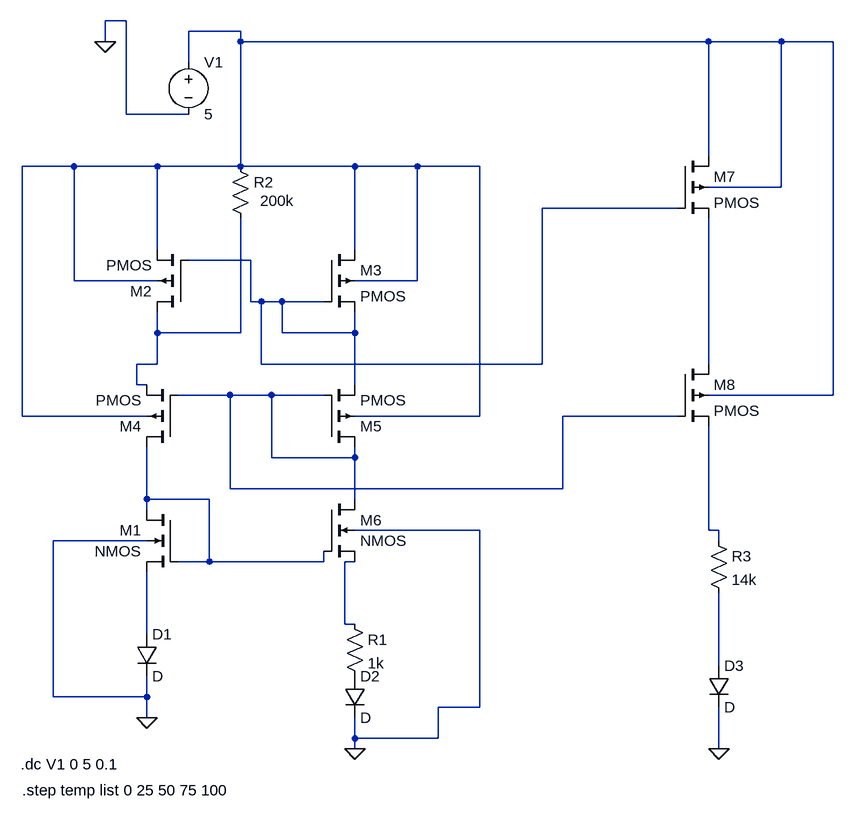
[diagram p0: schematic BANDGAP_REFERENCE_CIRCUIT.asc]
BANDGAP_REFERENCE_CIRCUIT.asc, the LTspice schematic file:
Version 4
SHEET 1 880 768
WIRE -224 -432 -256 -432
WIRE -48 -416 -128 -416
WIRE -256 -400 -256 -432
WIRE -48 -400 -48 -416
WIRE 672 -400 -48 -400
WIRE 784 -400 672 -400
WIRE 864 -400 784 -400
WIRE -128 -368 -128 -416
WIRE -224 -288 -224 -432
WIRE -128 -288 -224 -288
WIRE 672 -224 672 -400
WIRE -304 -208 -384 -208
WIRE -176 -208 -304 -208
WIRE -48 -208 -48 -400
WIRE -48 -208 -176 -208
WIRE 128 -208 -48 -208
WIRE 224 -208 128 -208
WIRE 320 -208 224 -208
WIRE 784 -176 784 -400
WIRE 784 -176 672 -176
WIRE 624 -144 416 -144
WIRE -176 -80 -176 -208
WIRE 128 -80 128 -208
WIRE -32 -64 -128 -64
WIRE -304 -32 -304 -208
WIRE -176 -32 -304 -32
WIRE 224 -32 224 -208
WIRE 224 -32 128 -32
WIRE -32 0 -32 -64
WIRE -16 0 -32 0
WIRE 16 0 -16 0
WIRE 80 0 16 0
WIRE -176 48 -176 16
WIRE -48 48 -48 -128
WIRE -48 48 -176 48
WIRE 16 48 16 0
WIRE 128 48 128 16
WIRE 128 48 16 48
WIRE -176 96 -176 48
WIRE -176 96 -208 96
WIRE -16 96 -16 0
WIRE 416 96 416 -144
WIRE 416 96 -16 96
WIRE 672 96 672 -128
WIRE -208 128 -208 96
WIRE -192 128 -208 128
WIRE 128 128 128 48
WIRE -64 144 -144 144
WIRE 0 144 -64 144
WIRE 80 144 0 144
WIRE 864 144 864 -400
WIRE 864 144 672 144
WIRE -384 176 -384 -208
WIRE -192 176 -384 176
WIRE 320 176 320 -208
WIRE 320 176 128 176
WIRE 624 176 448 176
WIRE 0 240 0 144
WIRE 128 240 128 224
WIRE 128 240 0 240
WIRE -64 288 -64 144
WIRE 448 288 448 176
WIRE 448 288 -64 288
WIRE -192 304 -192 224
WIRE -96 304 -192 304
WIRE 128 304 128 240
WIRE -192 320 -192 304
WIRE 320 352 128 352
WIRE 672 352 672 192
WIRE 688 352 672 352
WIRE -192 368 -336 368
WIRE 688 368 688 352
WIRE -96 400 -96 304
WIRE -96 400 -144 400
WIRE 80 400 80 384
WIRE 80 400 -96 400
WIRE 128 400 112 400
WIRE 112 496 112 400
WIRE 128 496 112 496
WIRE -192 512 -192 416
WIRE 688 560 688 448
WIRE -336 608 -336 368
WIRE -192 608 -192 576
WIRE -192 608 -336 608
WIRE 320 624 320 352
WIRE 320 624 256 624
WIRE -192 640 -192 608
WIRE 128 672 128 640
WIRE 256 672 256 624
WIRE 256 672 128 672
WIRE 128 688 128 672
WIRE 688 688 688 624
FLAG 128 688 0
FLAG -192 640 0
FLAG -256 -400 0
FLAG 688 688 0
SYMBOL nmos4 -144 320 M0
WINDOW 3 56 64 Left 2
SYMATTR InstName M1
SYMATTR Value2 l=1u w=25u
SYMBOL pmos4 -128 16 R180
SYMATTR InstName M2
SYMATTR Value2 l=1u w=50u
SYMBOL pmos4 80 -80 R0
SYMATTR InstName M3
SYMATTR Value2 l=1u w=50u
SYMBOL pmos4 -144 224 R180
SYMATTR InstName M4
SYMATTR Value2 l=1u w=50u
SYMBOL pmos4 80 224 M180
SYMATTR InstName M5
SYMATTR Value2 l=1u w=50u
SYMBOL nmos4 80 304 R0
WINDOW 3 56 64 Left 2
SYMATTR InstName M6
SYMATTR Value2 l=1u w=25u
SYMBOL res 112 480 R0
SYMATTR InstName R1
SYMATTR Value 1k
SYMBOL diode -208 512 R0
SYMATTR InstName D1
SYMBOL diode 112 576 R0
SYMATTR InstName D2
SYMBOL res -64 -224 R0
WINDOW 3 46 69 Left 2
SYMATTR InstName R2
SYMATTR Value 200k
SYMBOL voltage -128 -384 R0
WINDOW 123 0 0 Left 0
WINDOW 39 0 0 Left 0
SYMATTR InstName V1
SYMATTR Value 5
SYMBOL pmos4 624 -224 R0
SYMATTR InstName M7
SYMATTR Value2 l=1u w=100u
SYMBOL pmos4 624 96 R0
SYMATTR InstName M8
SYMATTR Value2 l=1u w=100u
SYMBOL res 672 352 R0
SYMATTR InstName R3
SYMATTR Value 14k
SYMBOL diode 672 560 R0
SYMATTR InstName D3
TEXT -386 712 Left 2 !.dc V1 0 5 0.1
TEXT -384 752 Left 2 !.step temp list 0 25 50 75 100

The netlist it stands for:
* BANDGAP_REFERENCE_CIRCUIT.asc
M1 N006 N006 N009 0 NMOS l=1u w=25u
M2 N003 N002 N001 N001 PMOS l=1u w=50u
M3 N001 N002 N002 N001 PMOS l=1u w=50u
M4 N006 N005 N003 N001 PMOS l=1u w=50u
M5 N005 N005 N002 N001 PMOS l=1u w=50u
M6 N005 N006 N008 0 NMOS l=1u w=25u
R1 N008 P001 1k
D1 N009 0 D
D2 P001 0 D
R2 N001 N003 200k
V1 N001 0 5
M7 N001 N002 N004 N001 PMOS l=1u w=100u
M8 N004 N005 N007 N001 PMOS l=1u w=100u
R3 N007 N010 14k
D3 N010 0 D
.model D D
.lib standard.dio
.model NMOS NMOS
.model PMOS PMOS
.lib standard.mos
.dc V1 0 5 0.1
.step temp list 0 25 50 75 100
.backanno
.end